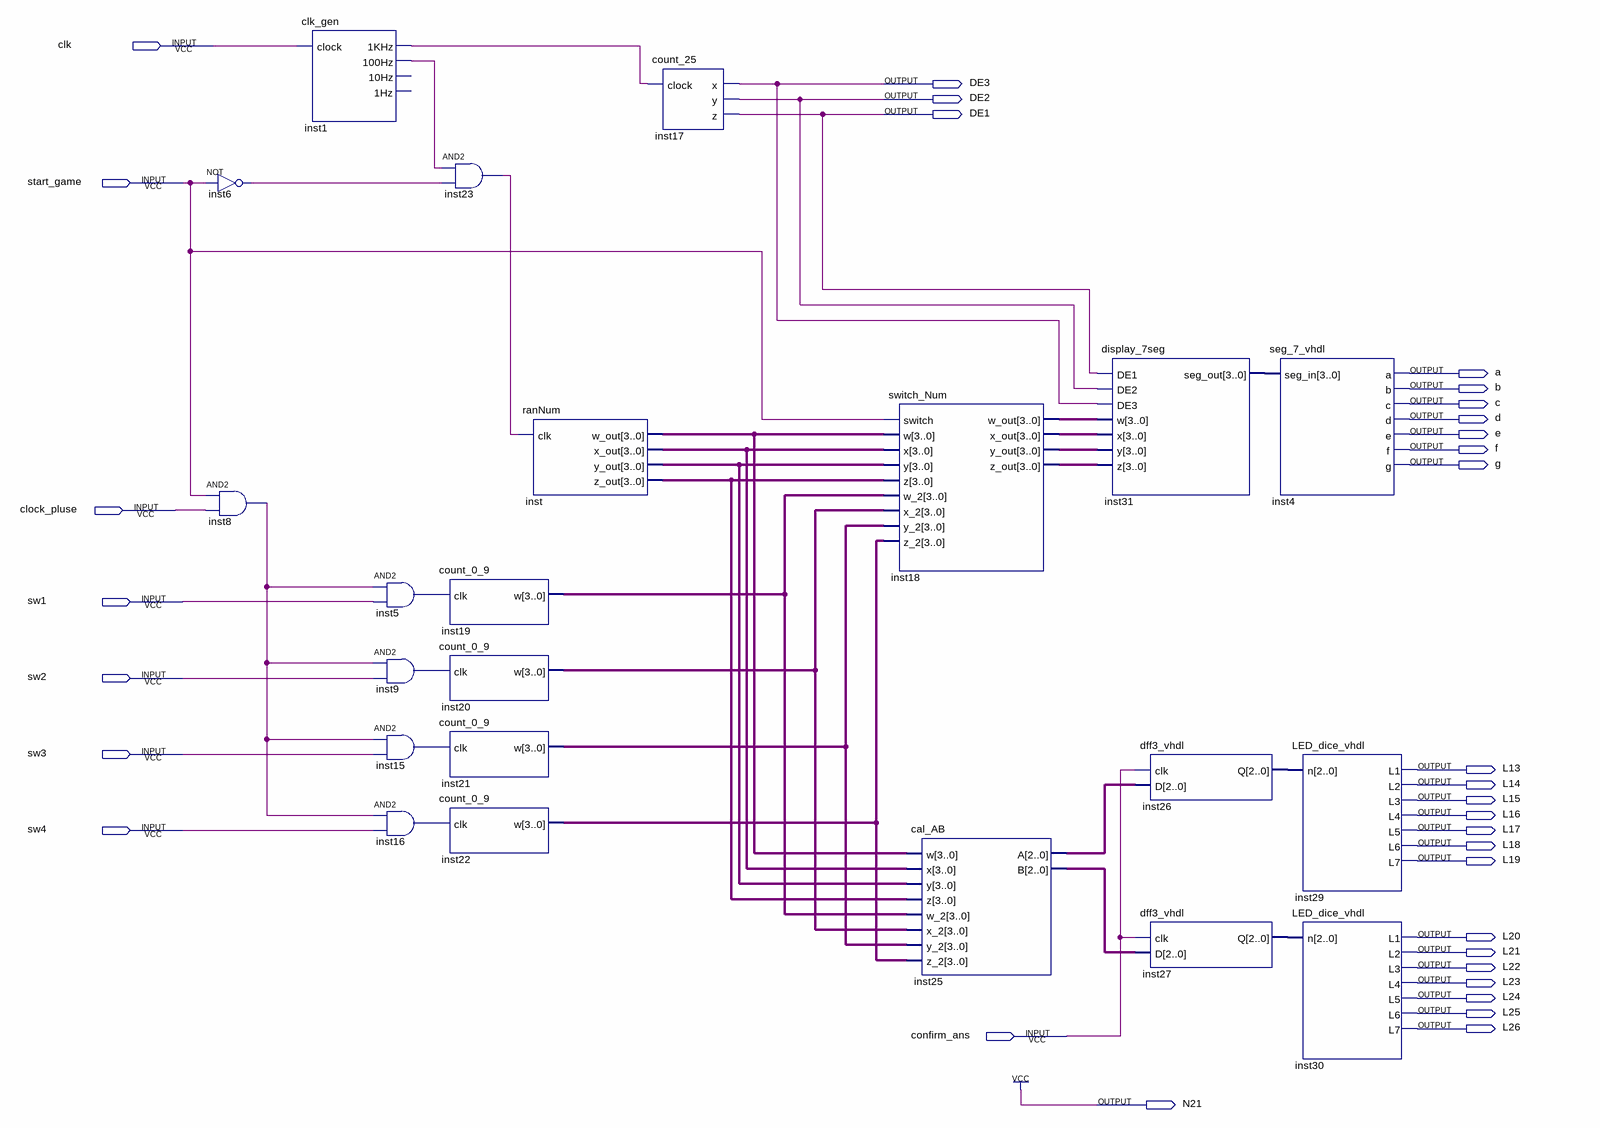
[diagram p0: schematic sheet]
// Quartus schematic Project_ver2.bdf as structural Verilog: 22 symbols, 33 pins
module Project_ver2 (
  input  clk,
  input  start_game,
  input  clock_pluse,
  input  sw1,
  input  sw2,
  input  sw3,
  input  sw4,
  input  confirm_ans,
  output DE3,
  output DE2,
  output DE1,
  output a,
  output b,
  output c,
  output d,
  output e,
  output f,
  output g,
  output L13,
  output L14,
  output L15,
  output L16,
  output L17,
  output L18,
  output L19,
  output L20,
  output L21,
  output L22,
  output L23,
  output L24,
  output L25,
  output L26,
  output N21
);

  wire inst1_1khz, inst1_100hz, inst5_out, inst6_out, inst8_out, inst9_out, inst15_out, inst16_out,
       inst23_out;
  wire [2:0] inst25_a, inst25_b, inst26_q, inst27_q;
  wire [3:0] inst18_w_out, inst18_x_out, inst18_y_out, inst18_z_out, inst19_w, inst20_w, inst21_w, inst22_w,
       inst31_seg_out, inst_w_out, inst_x_out, inst_y_out, inst_z_out;

  not inst6 (inst6_out, start_game);
  and inst8 (inst8_out, start_game, clock_pluse);
  clk_gen inst1 (.clock(clk), .\1KHz (inst1_1khz), .\100Hz (inst1_100hz));  // open: 10Hz, 1Hz
  and inst5 (inst5_out, inst8_out, sw1);
  and inst9 (inst9_out, inst8_out, sw2);
  and inst15 (inst15_out, inst8_out, sw3);
  and inst16 (inst16_out, inst8_out, sw4);
  count_0_9 inst19 (.clk(inst5_out), .w(inst19_w));
  count_0_9 inst20 (.clk(inst9_out), .w(inst20_w));
  count_0_9 inst21 (.clk(inst15_out), .w(inst21_w));
  count_0_9 inst22 (.clk(inst16_out), .w(inst22_w));
  and inst23 (inst23_out, inst1_100hz, inst6_out);
  ranNum inst (.clk(inst23_out), .w_out(inst_w_out), .x_out(inst_x_out), .y_out(inst_y_out), .z_out(inst_z_out));
  count_25 inst17 (.clock(inst1_1khz), .x(DE3), .y(DE2), .z(DE1));
  switch_Num inst18 (
    .switch(start_game), .w(inst_w_out), .x(inst_x_out), .y(inst_y_out), .z(inst_z_out), .w_2(inst19_w),
    .x_2(inst20_w), .y_2(inst21_w), .z_2(inst22_w), .w_out(inst18_w_out), .x_out(inst18_x_out),
    .y_out(inst18_y_out), .z_out(inst18_z_out));
  cal_AB inst25 (
    .w(inst_w_out), .x(inst_x_out), .y(inst_y_out), .z(inst_z_out), .w_2(inst19_w), .x_2(inst20_w),
    .y_2(inst21_w), .z_2(inst22_w), .A(inst25_a), .B(inst25_b));
  display_7seg inst31 (
    .DE1(DE1), .DE2(DE2), .DE3(DE3), .w(inst18_w_out), .x(inst18_x_out), .y(inst18_y_out), .z(inst18_z_out),
    .seg_out(inst31_seg_out));
  dff3_vhdl inst26 (.clk(confirm_ans), .D(inst25_a), .Q(inst26_q));
  dff3_vhdl inst27 (.clk(confirm_ans), .D(inst25_b), .Q(inst27_q));
  seg_7_vhdl inst4 (.seg_in(inst31_seg_out), .a(a), .b(b), .c(c), .d(d), .e(e), .f(f), .g(g));
  LED_dice_vhdl inst29 (.n(inst26_q), .L1(L13), .L2(L14), .L3(L15), .L4(L16), .L5(L17), .L6(L18), .L7(L19));
  LED_dice_vhdl inst30 (.n(inst27_q), .L1(L20), .L2(L21), .L3(L22), .L4(L23), .L5(L24), .L6(L25), .L7(L26));

  assign N21 = 1'b1;
endmodule
